# Altium project USB-I2C.PrjPcb
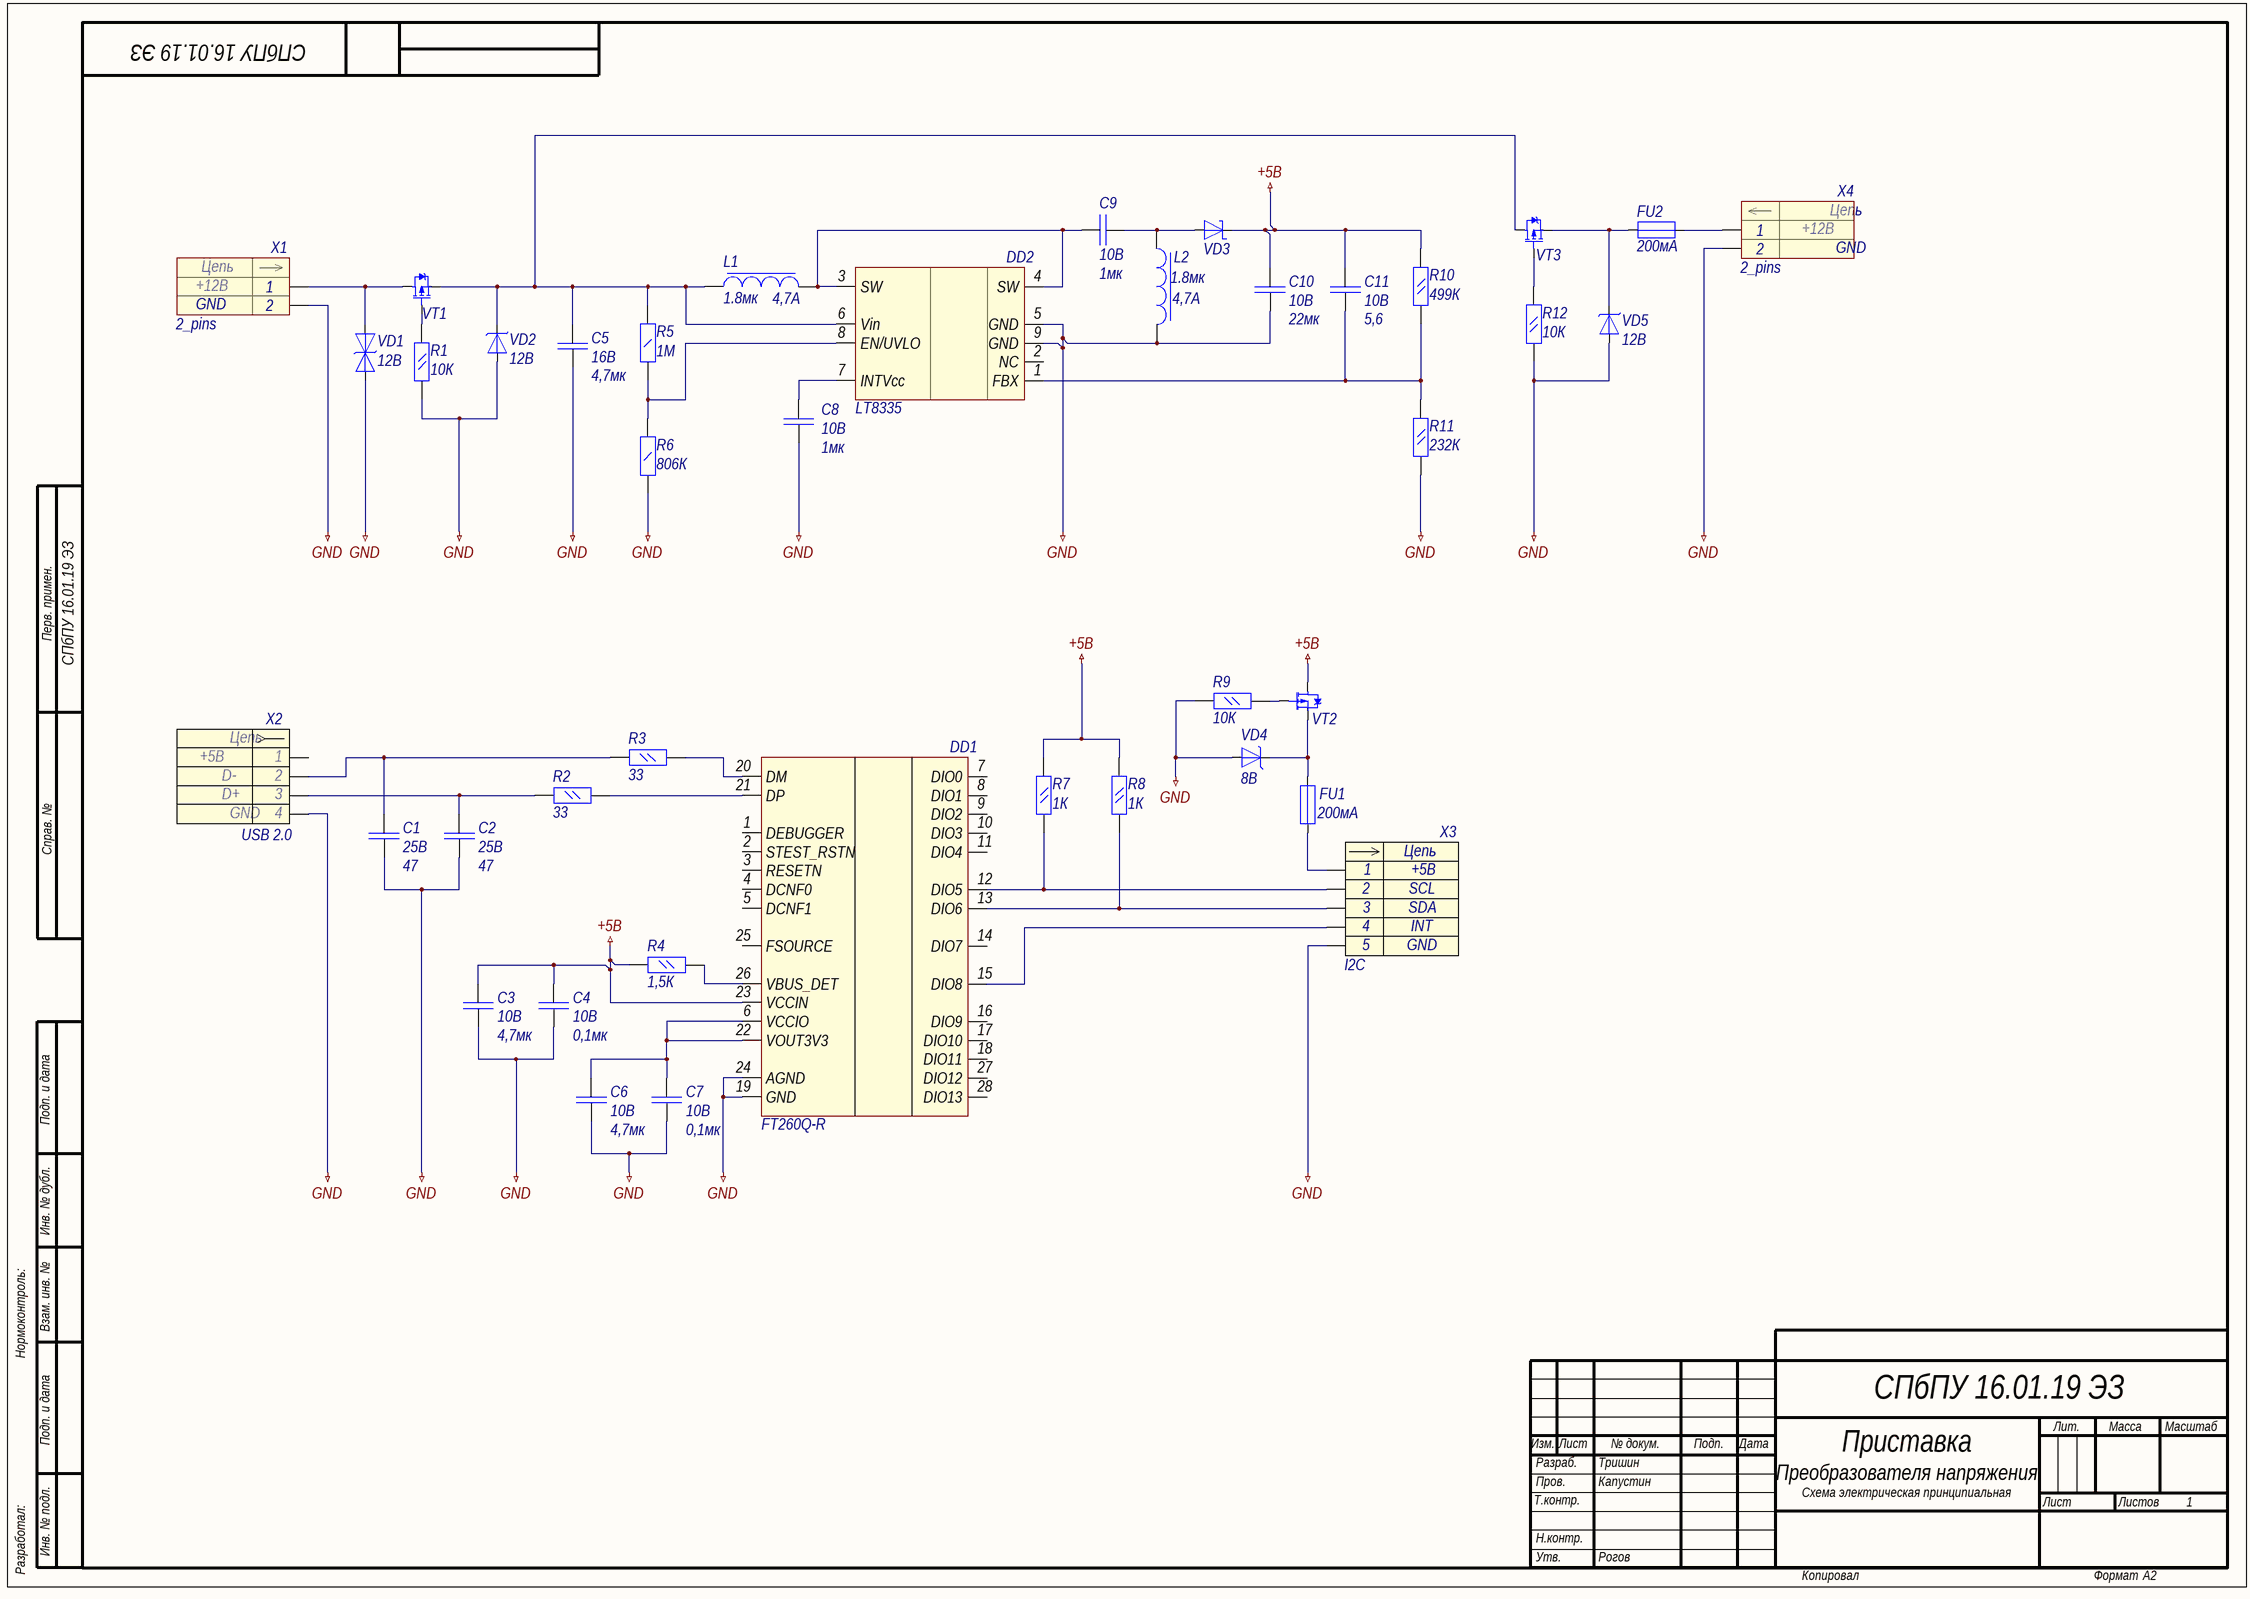
[diagram p0: USB-I2C_A2.SchDoc]
1 sheet, 41 parts. Net scope: global (net labels, ports and power ports of the same name join across sheets).
Board file: USB-I2C.PcbDoc

## Sheet USB-I2C_A2.SchDoc: Приставка
size 594 x 420 mm; ApprovedBy: Рогов; CheckedBy: Капустин; DrawnBy: Тришин; DocumentNumber: СПбПУ 16.01.19 ЭЗ; SheetTotal: 1; Format: A2; DocumentType: Схема электрическая принципиальная; Title1str: Преобразователя напряжения; ImagePath: СПбПУ 16.01.19 ЭЗ

### Parts
C1  Voltage: 25В  Capacitance: 47  [CH0201C]  (hidden comment: Capacitor)
C2  Voltage: 25В  Capacitance: 47  [CH0201C]  (hidden comment: Capacitor)
C3  Voltage: 10В  Capacitance: 4,7мк  [CH0402C]  (hidden comment: Capacitor)
C4  Voltage: 10В  Capacitance: 0,1мк  [CH0402C]  (hidden comment: Capacitor)
C5  Voltage: 16В  Capacitance: 4,7мк  [CH0603C]  (hidden comment: Capacitor)
C6  Voltage: 10В  Capacitance: 4,7мк  [CH0402C]  (hidden comment: Capacitor)
C7  Voltage: 10В  Capacitance: 0,1мк  [CH0402C]  (hidden comment: Capacitor)
C8  Voltage: 10В  Capacitance: 1мк  [CH0201C]  (hidden comment: Capacitor)
C9  Voltage: 10В  Capacitance: 1мк  [CH0201C]  (hidden comment: Capacitor)
C10  Voltage: 10В  Capacitance: 22мк  [CH0603C]  (hidden comment: Capacitor)
C11  Voltage: 10В  Capacitance: 5,6  [CH0201C]  (hidden comment: Capacitor)
DD1  FT260Q-R  [FT260-Q]
DD2  LT8335  [LT8335]
FU1  value 200мА  [CH0402R]  (hidden comment: Fuse)
FU2  value 200мА  [CH0402R]  (hidden comment: Fuse)
L1  Max DC current: 4,7А  Inductance: 1.8мк  [IND: DRQ127]  (hidden comment: Ferrite bead)
L2  Max DC current: 4,7А  Inductance: 1.8мк  [IND: DRQ127]  (hidden comment: Ferrite bead)
R1  Impedance: 10К  [CH0402R]  (hidden comment: Res_0.125)
R2  Impedance: 33  [CH0402R]  (hidden comment: Res_0.125)
R3  Impedance: 33  [CH0402R]  (hidden comment: Res_0.125)
R4  Impedance: 1,5К  [CH0402R]  (hidden comment: Res_0.125)
R5  Impedance: 1М  [CH0805R]  (hidden comment: Res_0.5)
R6  Impedance: 806К  [CH0805R]  (hidden comment: Res_0.5)
R7  Impedance: 1К  [CH0402R]  (hidden comment: Res_0.125)
R8  Impedance: 1К  [CH0402R]  (hidden comment: Res_0.125)
R9  Impedance: 10К  [CH0402R]  (hidden comment: Res_0.125)
R10  Impedance: 499К  [CH0805R]  (hidden comment: Res_0.125)
R11  Impedance: 232К  [CH0805R]  (hidden comment: Res_0.125)
R12  Impedance: 10К  [CH0402R]  (hidden comment: Res_0.125)
VD1  Clamping Voltage: 12В  [CH0201L]  (hidden comment: TVS-diod_simmetrical)
VD2  Clamping_Voltage: 12В  [DO214AA]  (hidden comment: TVS-diod_directed)
VD3  Diod Schottky  [SOT23_132]  (value not drawn)
VD4  Clamping_Voltage: 8В  [SOD123W]  (hidden comment: TVS-diod_directed)
VD5  Clamping_Voltage: 12В  [DO214AA]  (hidden comment: TVS-diod_directed)
VT1  *  [SOT23_132]  (value not drawn)
VT2  *  [SOT23_132]  (value not drawn)
VT3  *  [SOT23_132]  (value not drawn)
X1  2_pins  Vcc: +12В  [CON: 163-179PH-EX]
X2  USB 2.0  Vcc: +5В  [USB]
X3  I2C  [CON: PBS-5]
X4  2_pins  Vcc: +12В  [CON: PBS-2]

### Nets
+5В: C3.1(C1+) C4.1(C1+) C10.1(C1+) C11.1(C1+) DD1.23(VCCIN) R4.2(C1-) R7.1(C1-) R8.1(C1-) R10.1(C1-) VD3.2 VT2.2(D)
GND: C1.2(C1-) C2.2(C1-) C3.2(C1-) C4.2(C1-) C5.2(C1-) C6.2(C1-) C7.2(C1-) C8.2(C1-) C10.2(C1-) DD1.19(GND) DD1.24(AGND) DD2.5(GND) DD2.9(GND) L2.2 R1.2(C1-) R6.1(C1-) R9.2(C1-) R11.2(C1-) R12.1(C1-) VD1.1(A) VD2.1(A) VD4.1(A) VD5.1(A) X1.2 X2.4 X3.5 X4.2
NetC1_1: C1.1(C1+) R3.2(C1-) X2.2
NetC2_1: C2.1(C1+) R2.2(C1-) X2.3
NetC5_1: C5.1(C1+) DD2.6(Vin) L1.1(C1-) R5.2(C1-) VD2.2(C) VT1.3(S) VT3.2(D)
NetC6_1: C6.1(C1+) C7.1(C1+) DD1.6(VCCIO) DD1.22(VOUT3V3)
NetC8_1: C8.1(C1+) DD2.7(INTVcc)
NetC9_1: C9.1(C1+) DD2.3(SW) DD2.4(SW) L1.2
NetC9_2: C9.2(C1-) L2.1(C1-) VD3.1
NetC11_2: C11.2(C1-) DD2.1(FBX) R10.2(C1-) R11.1(C1-)
NetDD1_12: DD1.12(DIO5) R7.2(C1-) X3.2
NetDD1_13: DD1.13(DIO6) R8.2(C1-) X3.3
NetDD1_15: DD1.15(DIO8) X3.4
NetDD1_20: DD1.20(DM) R3.1(C1-)
NetDD1_21: DD1.21(DP) R2.1(C1-)
NetDD1_26: DD1.26(VBUS_DET) R4.1(C1-)
NetDD2_8: DD2.8(EN/UVLO) R5.1(C1-) R6.2(C1-)
NetFU1_1: FU1.1 X3.1
NetFU1_2: FU1.2 VD4.2(C) VT2.3(S)
NetFU2_1: FU2.1 VD5.2(C) VT3.3(S)
NetFU2_2: FU2.2 X4.1
NetR1_1: R1.1(C1-) VT1.1(G)
NetR9_1: R9.1(C1-) VT2.1(G)
NetR12_2: R12.2(C1-) VT3.1(G)
NetVD1_2: VD1.2(C) VT1.2(D) X1.1

Not connected (* = marked no-connect by the designer): DD1 1(DEBUGGER) 2(STEST_RSTN) 3(RESETN) 4(DCNF0) 5(DCNF1) 7(DIO0) 8(DIO1) 9(DIO2) 10(DIO3) 11(DIO4) 14(DIO7) 16(DIO9) 17(DIO10) 18(DIO11) 25(FSOURCE) 27(DIO12) 28(DIO13); DD2 2(NC); X2 1

### Notes on the sheet
- Перв. примен.
- Справ. №
- Подп. и дата
- Инв. № дубл.
- Нормоконтроль:
- Взам. инв. №
- Изм.
- Лист
- № докум.
- Подп.
- Дата
- Лит.
- Масса
- Масштаб
- Т.контр.
- Пров.
- Разраб.
- Листов
- Разработал:
- Инв. № подл.
- Н.контр.
- Утв.
- Копировал
- Формат
- (in symbol 2_pins) Цепь; GND
- (in symbol connect6) Цепь
- (in symbol USB-A) Цепь; D-; D+; GND

### Library data of the parts
C1 C2 = Capacitor: Manufacture: TDK; Model: CGA1A2C0G1E470J030BA; Case: 0201; HelpURL: https://ru.mouser.com/ProductDetail/TDK/CGA1A2C0G1E470J030BA?qs=LcTL%2f5vFEzGP84WOj%2f5Msw==&utm_source=netcomponents&utm_medium=aggregator&utm_campaign=CGA1A2C0G1E470J030BA&utm_term=CGA1A2C0G1E470J030BA&utm_content=TDK
C3 C6 = Capacitor: Manufacture: Murata Electronics; Model: ZRB15XR61A475KE01D; Case: 0402; HelpURL: https://ru.mouser.com/ProductDetail/Murata-Electronics/ZRB15XR61A475KE01D?qs=sGAEpiMZZMs0AnBnWHyRQO9VYadaKTO%252beZnE9zFUsbv4FmCibz4ZfQ%3d%3d
C4 C7 = Capacitor: Manufacture: AVX; Model: 0402ZD103KAT2A; Case: 0402; HelpURL: https://ru.mouser.com/ProductDetail/AVX/0402ZD103KAT2A?qs=sGAEpiMZZMs0AnBnWHyRQKdiqyDPVQdAu74W%2fwwRq8A%3d
C5 = Capacitor: Manufacture: Murata Electronics; Model: GRM188R61C475KAAJD; Case: 0603; HelpURL: https://ru.mouser.com/ProductDetail/Murata-Electronics/GRM188R61C475KAAJD?qs=sGAEpiMZZMs0AnBnWHyRQHS%2f3XE0oMwxE3tFP4oDIiY%3d
C8 C9 = Capacitor: Manufacture: Murata Electronics; Model: GRM033C81A105ME05E; Case: 0201; HelpURL: https://ru.mouser.com/ProductDetail/Murata-Electronics/GRM033C81A105ME05E?qs=sGAEpiMZZMs0AnBnWHyRQN7%2fAA2D2lPPXfhIkJ3ChWM%252bNp28BKy3Ug%3d%3d
C10 = Capacitor: Manufacture: Murata Electronics; Model: ZRB18AR61A226ME01L; Case: 0603; HelpURL: https://ru.mouser.com/ProductDetail/Murata-Electronics/ZRB18AR61A226ME01L?qs=sGAEpiMZZMs0AnBnWHyRQN7%2fAA2D2lPPknK%252bZ26wfT%2fc2YZrPwOUrA%3d%3d
C11 = Capacitor: Manufacture: KEMET; Model: CBR02C569D8GAC; Case: 0201; HelpURL: https://ru.mouser.com/ProductDetail/KEMET/CBR02C569D8GAC?qs=sGAEpiMZZMs0AnBnWHyRQKJCfzG%2fi9wHO4Sz%252bJJDLvGSjWY7CQ%2fxZQ%3d%3d
DD1 = FT260Q-R: IC BRIDGE USB TO UART/I2C 28WQFN; Manufacture: FTDI, Future Technology Devices International Ltd; Model: FT260Q-R; Case: 28-WQFN (5x5); HelpURL: https://www.digikey.com/product-detail/en/ftdi-future-technology-devices-international-ltd/FT260Q-R/FT260Q-RTR-ND/5956531
DD2 = LT8335: 4~16 to 5; Model: LT8335; Case: *; HelpURL: https://www.analog.com/en/products/lt8335.html#product-overview; Manufacture: *
L1 L2 = Ferrite bead: Manufacture: Wurth Electronics; Model: 744877001; Impedance: 25мОм; Case: *; HelpURL: https://www2.mouser.com/ProductDetail/Wurth-Electronics/744877001?qs=%2fha2pyFaduiBH%252bVtwFFo7m4jeDBiCtVkn%2fV2DZvEkMQ%3d
R1 R9 R12 = Res_0.125: Manufacture: Yageo; Model: AC0402FR-7W10KL; Case: 0402; HelpURL: https://ru.mouser.com/ProductDetail/Yageo/AC0402FR-7W10KL?qs=sGAEpiMZZMvdGkrng054txbN%2f5LBcxld3gyqgmBuiXRPLjwmdNqO3A%3d%3d
R2 R3 = Res_0.125: Manufacture: TE Connectivity / Holsworthy; Model: CRGP0402F33R; Case: 0402; HelpURL: https://ru.mouser.com/ProductDetail/TE-Connectivity-Holsworthy/CRGP0402F33R?qs=sGAEpiMZZMvdGkrng054tz1y1XEHv7sN6aY9AoYHboGDePQNpV5Q0w%3d%3d
R4 = Res_0.125: Manufacture: TE Connectivity / Holsworthy; Model: CRGP0402F1K5; Case: 0402; HelpURL: https://ru.mouser.com/ProductDetail/TE-Connectivity-Holsworthy/CRGP0402F1K5?qs=sGAEpiMZZMvdGkrng054tz1y1XEHv7sNNFRrkK9abQmLny45pEqOiQ%3d%3d
R5 = Res_0.5: Manufacture: KOA Speer; Model: SG73G2ATTD1004D; HelpURl: https://ru.mouser.com/ProductDetail/KOA-Speer/SG73G2ATTD1004D?qs=sGAEpiMZZMvdGkrng054tz1y1XEHv7sNqdEHfKLpAGs6ZpwyMDczVg%3d%3d; Case: 0805
R6 = Res_0.5: Manufacture: Panasonic; Model: ERJ-P06F8063V; HelpURl: https://ru.mouser.com/ProductDetail/Panasonic/ERJ-P06F8063V?qs=sGAEpiMZZMvdGkrng054t5hHekyimr992M3FN7jjBTE%3d; Case: 0805
R7 R8 = Res_0.125: Manufacture: KOA Speer; Model: SG73P1ETTP1001F; Case: 0402; HelpURL: https://ru.mouser.com/ProductDetail/KOA-Speer/SG73P1ETTP1001F?qs=sGAEpiMZZMvdGkrng054t%2f16WM9J8YovCYtiWkW5%2faA%3d
R10 = Res_0.125: Manufacture: Panasonic Industrial Devices; Model: ERJ-6ENF4993V; Case: 0805; HelpURL: https://ru.mouser.com/ProductDetail/Panasonic-Industrial-Devices/ERJ-6ENF4993V?qs=sGAEpiMZZMvdGkrng054t7mzY140rHw%252bZDSgtKJeHpI%3d
R11 = Res_0.125: Manufacture: Panasonic Industrial Devices; Model: ERJ-6ENF2323V; Case: 0805; HelpURL: https://ru.mouser.com/ProductDetail/Panasonic-Industrial-Devices/ERJ-6ENF2323V?qs=sGAEpiMZZMvdGkrng054tx7%2f6%252bNA3LAJkwXIsOwAlfs%3d
VD1 = TVS-diod_simmetrical: Manufacturer: Littelfuse; Model: SP3022-01WTG; HelpURL: https://ru.mouser.com/ProductDetail/Littelfuse/SP3022-01WTG?qs=sGAEpiMZZMsItbzKdwyIez7NGmqnzL8h47KYC2e%252bM%2f4NVETz1A7KGA%3d%3d; Case: 0201
VD2 VD5 = TVS-diod_directed: Manufacturer: Bourns; Model: CD214B-T7.0ALF; HelpURL: https://ru.mouser.com/ProductDetail/Bourns/CD214B-T70ALF?qs=sGAEpiMZZMsItbzKdwyIexL102H4jKkFOiaKL2EcEgo%3d; Ipp: *; Case: DO-214AA-2
VD3 = Diod Schottky: Manufacturer: Toshiba; Model: 1SS374(TE85L,F); If: 200мА; Vrrm: 15В; ComponentKind: *; HelpURL: https://ru.mouser.com/ProductDetail/Toshiba/1SS374TE85LF?qs=sGAEpiMZZMtQ8nqTKtFS%2fOl9H8JU2QXlyYvmz0vcRmull8rlMQPxpQ%3d%3d
VD4 = TVS-diod_directed: Manufacturer: Nexperia; Model: PTVS3V3S1UTR,115; HelpURL: https://ru.mouser.com/ProductDetail/Nexperia/PTVS3V3S1UTR115?qs=sGAEpiMZZMsItbzKdwyIe55sLWjhUV0FnMtsDZGUovc%3d; Ipp: *; Case: SOD-123W
VT1 VT3 = P-Channel: Manufacture: Diodes Incorporated; Id: 2,4А; Model: DMG2301LK-7; Vgs: 300мВ; Vsd: 20В; HelpURL: https://ru.mouser.com/ProductDetail/Diodes-Incorporated/DMG2301LK-7?qs=sGAEpiMZZMshyDBzk1%2fWi3VK%2fMVeCy7TGgocA8mg7FfG8rajAhy0Kw%3d%3d
VT2 = P-Channel: Manufacture: Vishay / Siliconix; Id: 6А; Model: SI2329DS-T1-GE3; Vgs: 350мВ; Vsd: 8В; HelpURL: https://ru.mouser.com/ProductDetail/Vishay-Siliconix/SI2329DS-T1-GE3?qs=sGAEpiMZZMshyDBzk1%2fWi0IfsQ3%2f3bgnEGeh9AiMdAo%3d
X2 = USB-A: USB; Manufacturer: TE Connectivity; Model: 292303-2; HelpURL: https://www2.mouser.com/ProductDetail/Wurth-Electronics/629004113921?qs=35zkduByVmhHRkVkRjAlEQ==; ComponentKind: type A
X3 = connect6: Разъем - 5 конт. вилка; Contact_1: +5В; Contact_2: SCL; Contact_3: SDA; Contact_4: INT; Contact_5: GND; Etch: 2,54mm; HelpURL: https://ru.mouser.com/ProductDetail/Harwin/M50-3140545?qs=sGAEpiMZZMs%252bGHln7q6pm8Vn94ktop%2FJbKjRjRRkUDI6c9DH7Y2OdA%3D%3D
FU1 FU2 = Fuse: HelpURL: https://www2.mouser.com/ProductDetail/Bourns/SF-0402FP020F-2?qs=sGAEpiMZZMtxU2g%2f1juGqWJziY9CkRY0v%252bd32oCrRTr%2fW8XqdHGjQA%3d%3d
X1 X4 = 2_pins
  X1: HelpURL: https://ru.farnell.com/gct-global-connector-technology/dcj250-10-a-k1-k/dc-power-jack-5a-20vdc-black/dp/2524130?st=power%20jack
  X4: HelpURL: https://ru.mouser.com/ProductDetail/Harwin/M50-3140245R?qs=sGAEpiMZZMs%252bGHln7q6pm8Vn94ktop%2FJtmD0IM0sqjtMooR%2Fqw0FIA%3D%3D